# Altium schematic sheet Conditioning.SchDoc
size A4; SheetNumber: 4; SheetTotal: 5
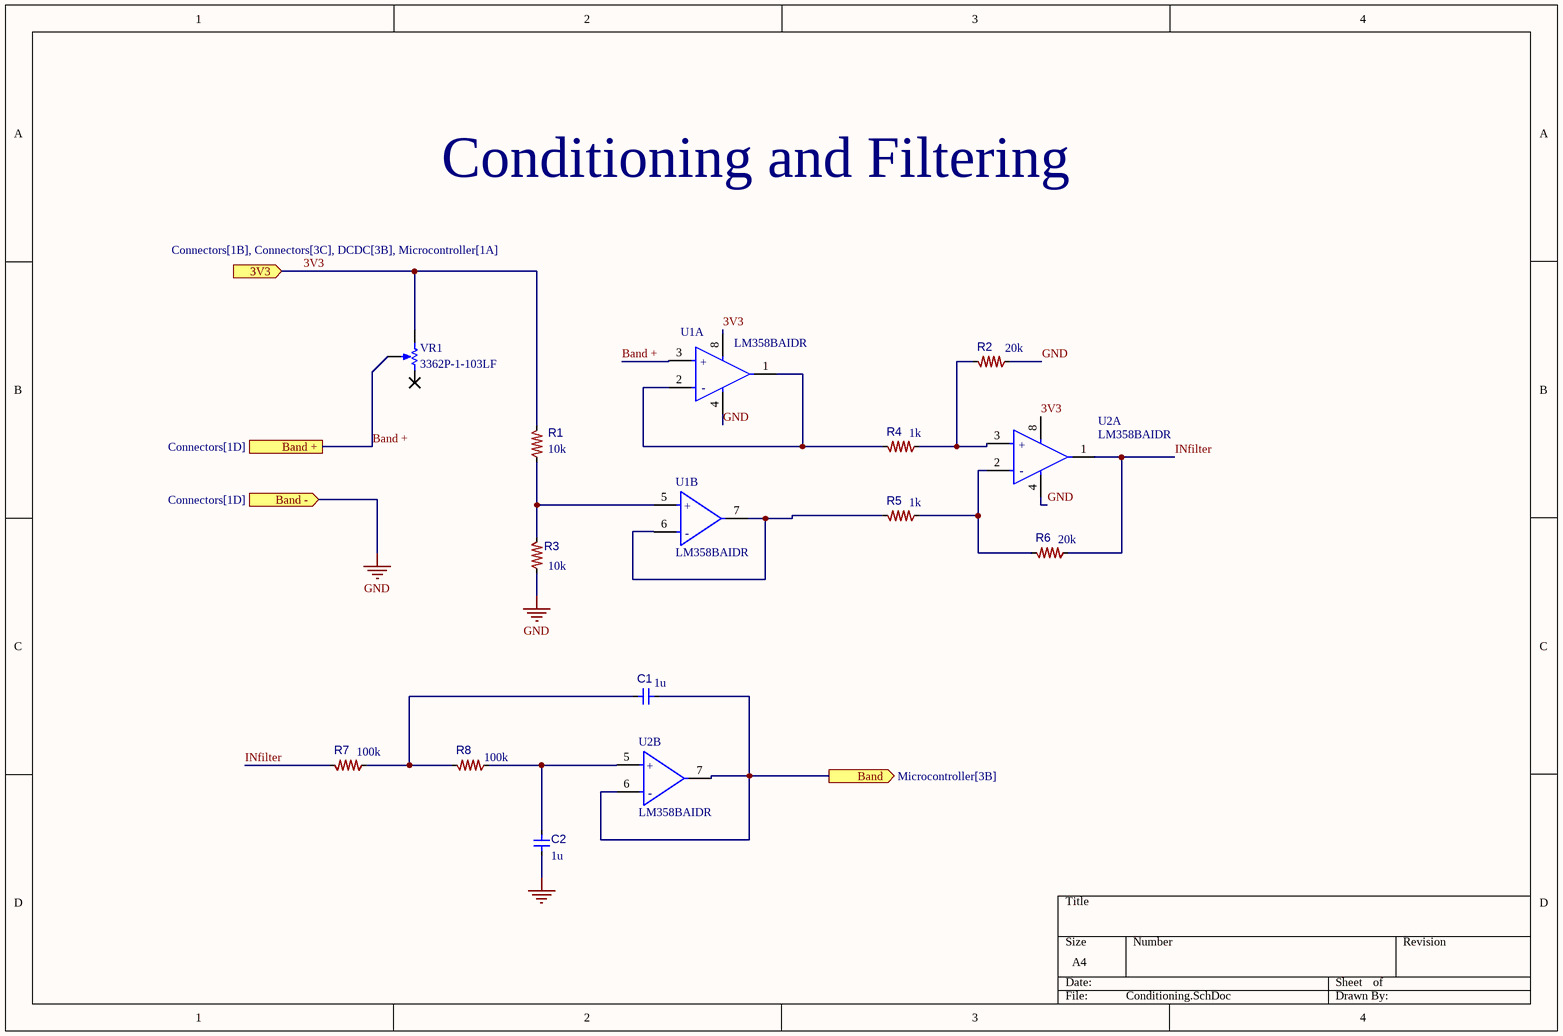
[diagram p0: Conditioning.SchDoc]

## Parts
C1  C309479  [New footprint 1]  (value not drawn)
C2  C309479  [New footprint 1]  (value not drawn)
R1  C103210  [0603 resistor-Footprint-1]  (value not drawn)
R2  (no value)  [0603 resistor-Footprint-1]
R3  C103210  [0603 resistor-Footprint-1]  (value not drawn)
R4  C103198  [0603 resistor-Footprint-1]  (value not drawn)
R5  C103198  [0603 resistor-Footprint-1]  (value not drawn)
R6  (no value)  [0603 resistor-Footprint-1]
R7  C153133  [0603 resistor-Footprint-1]  (value not drawn)
R8  C153133  [0603 resistor-Footprint-1]  (value not drawn)
U1  LM358BAIDR  [FP-D0008A-IPC_A]  (parts A,B of 2)
U2  LM358BAIDR  [FP-D0008A-IPC_A]  (parts A,B of 2)
VR1  3362P-1-103LF  [BOUR-3362P]

## Ports
3V3 (in, see Connectors[1B], Connectors[3C], DCDC[3B], Microcontroller[1A]), Band (out, see Microcontroller[3B]), Band + (see Connectors[1D]), Band - (in, see Connectors[1D])

## Nets
GND: C2.1 R2.2 R3.2 U1.4(V-) U2.4(V-) ; port Band -
3V3: R1.1 U1.8(V+) U2.8(V+) VR1.1(CCW) ; port 3V3
Band: C1.2 U2.6(IN2-) U2.7(OUT2) ; port Band
Band +: U1.3(IN1+) VR1.2(S) ; port Band +
INfilter: R6.2 R7.1 U2.1(OUT1)
NetC1_1: C1.1 R7.2 R8.1
NetC2_2: C2.2 R8.2 U2.5(IN2+)
NetR1_2: R1.2 R3.1 U1.5(IN2+)
NetR2_1: R2.1 R4.2 U2.3(IN1+)
NetR4_1: R4.1 U1.1(OUT1) U1.2(IN1-)
NetR5_1: R5.1 U1.7(OUT2)
NetR5_2: R5.2 R6.1 U2.2(IN1-)

Not connected (* = marked no-connect by the designer): U1 6(IN2-); VR1 3(CW)

## Notes on the sheet
- Conditioning and Filtering
- (near R2) 20k
- (near R1) 10k
- (near R4) 1k
- (near R5) 1k
- (near R3) 10k
- (near R6) 20k
- (near C1) 1u
- (near R7) 100k
- (near R8) 100k
- (near C2) 1u
- (in symbol CMP-04895-000406-1, part A) +; -
- (in symbol CMP-04895-000406-1, part B) +; -

## Library data of the parts
C1 C2 = CMP-001-00083-1: 6.3V 1uF X7R ±10% 0603  Multilayer Ceramic Capacitors MLCC - SMD/SMT ROHS
R1 R3 = CMP-009-00177-1: 100mW Thick Film Resistors ±100ppm/℃ ±5% 10kΩ 0603 Chip Resistor - Surface Mount ROHS
R2 R6 = CMP-009-00177-1
R4 R5 = CMP-009-00177-1: 100mW ±100ppm/℃ ±1% 1kΩ 0603  Chip Resistor - Surface Mount ROHS
R7 R8 = CMP-009-00177-1: 100mW Thick Film Resistors ±5% ±200ppm/℃ 100kΩ 0603 Chip Resistor - Surface Mount ROHS
U1 U2 = CMP-04895-000406-1: SOP-8  Operational Amplifier ROHS
VR1 = CMP-009-00039-3: ±10% ±100ppm/℃ 500mW 10kΩ Plugin  Variable Resistors/Potentiometers ROHS; Manufacturer: Bourns; Resistance: 10k; Voltage Rating: 300V; Package Description: 3-Pin Through Hole Device, Body 6.6 x 6.99 mm, Pitch 2.54 mm; Tolerance: 10%; Case/Package: 3326P; Composition: Potentiometer di LUCA; Packaging: Rail/Tube; Package Reference: 3326P; Power: 500mW; RoHS Compliant: True; Package Quantity: 250; Pins: 3; Lead Pitch: 2.54mm